# Altium project SYZYGY_PMOD_Schield.PrjPcb
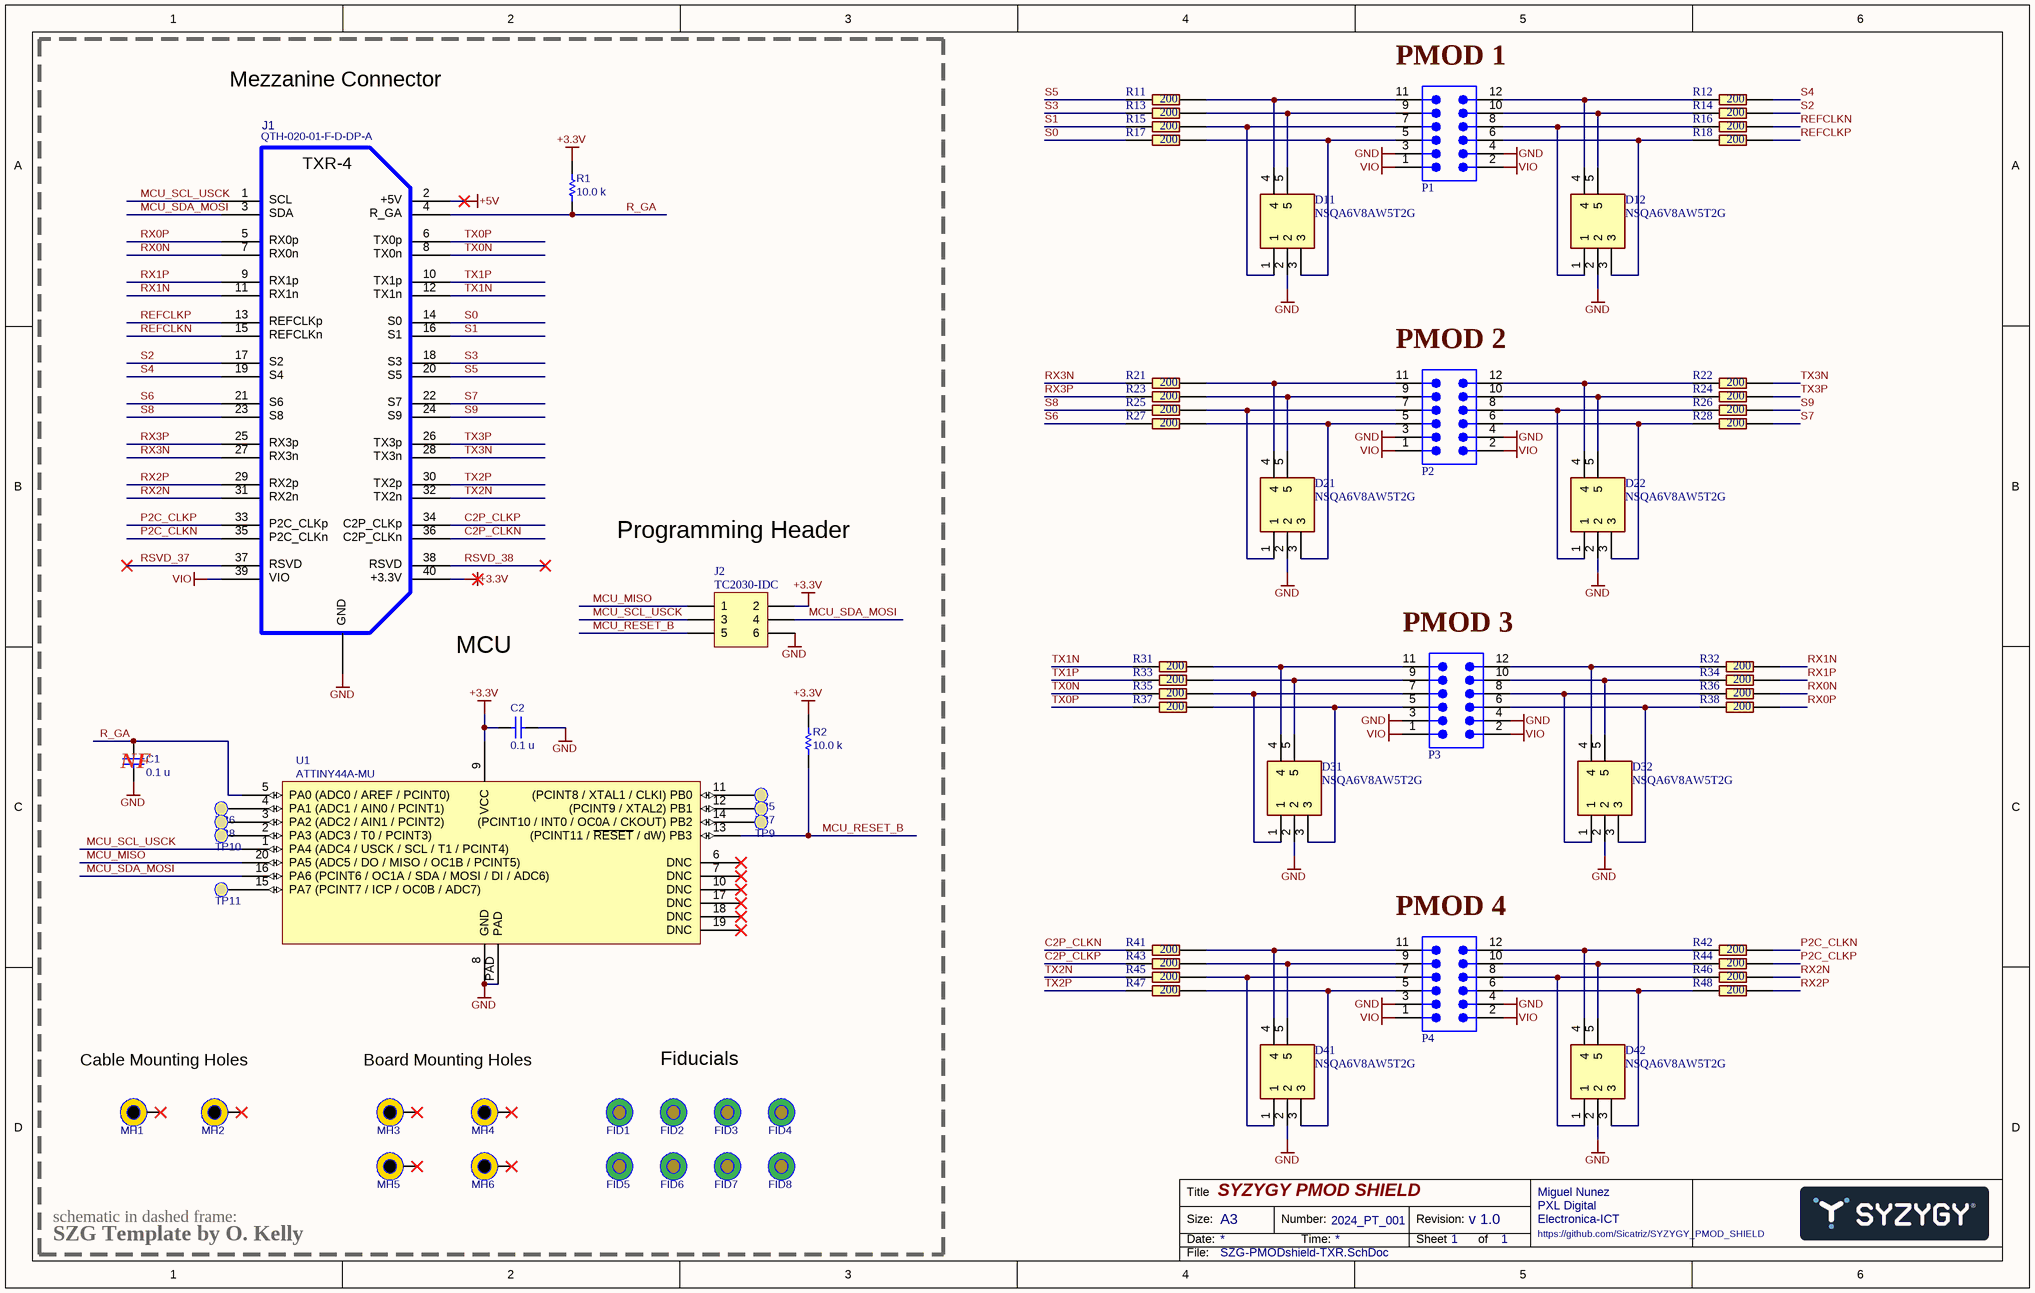
[diagram p0: SZG-PMODshield-TXR.SchDoc]
1 sheet, 72 parts. Net scope: global (net labels, ports and power ports of the same name join across sheets).
Board file: SZG-PMOD-TXR.PcbDoc

## Sheet SZG-PMODshield-TXR.SchDoc: SZG-TEMPLATE-TXR
size B; Organization: Opal Kelly; Address1: 13500 SW 72nd Ave STE 100; Address2: Portland, OR  97223; Address3: 217.391.3724; Address4: http://www.opalkelly.com; DocumentNumber: xxx; Revision: 1; SheetNumber: 1; SheetTotal: 1; PageSetup: Record=PageOptions|CenterHorizontal=True|CenterVertical=True|PrintScale=0.52|XCorrection=1.00|YCorrection=1.00|PrintKind=0|BorderSize=5000000|LeftOffset=0|BottomOffset=0|Orientation=2|PaperLength=1000|PaperWidth=1000|Scale=100|PaperSource=7|PrintQuality=-4|MediaType=1|DitherType=10|PaperKind=Letter|PrintScaleMode=1

### Parts
C1  value 0.1 u  [CAPC1005X06N]  (hidden comment: C0402C104K8PACTU)
C2  value 0.1 u  [CAPC1005X06N]  (hidden comment: C0402C104K8PACTU)
D11  NSQA6V8AW5T2G  [SOT65P210X110-5N]
D12  NSQA6V8AW5T2G  [SOT65P210X110-5N]
D21  NSQA6V8AW5T2G  [SOT65P210X110-5N]
D22  NSQA6V8AW5T2G  [SOT65P210X110-5N]
D31  NSQA6V8AW5T2G  [SOT65P210X110-5N]
D32  NSQA6V8AW5T2G  [SOT65P210X110-5N]
D41  NSQA6V8AW5T2G  [SOT65P210X110-5N]
D42  NSQA6V8AW5T2G  [SOT65P210X110-5N]
FID1  FIDUCIAL  [FID1MM/2MM-SS]  (value not drawn)
FID2  FIDUCIAL  [FID1MM/2MM-SS]  (value not drawn)
FID3  FIDUCIAL  [FID1MM/2MM-SS]  (value not drawn)
FID4  FIDUCIAL  [FID1MM/2MM-SS]  (value not drawn)
FID5  FIDUCIAL  [FID1MM/2MM-SS]  (value not drawn)
FID6  FIDUCIAL  [FID1MM/2MM-SS]  (value not drawn)
FID7  FIDUCIAL  [FID1MM/2MM-SS]  (value not drawn)
FID8  FIDUCIAL  [FID1MM/2MM-SS]  (value not drawn)
J1  manufacturer_pn: QTH-020-01-F-D-DP-A  [QTH-020-01-X-D-DP-A-L]  (hidden comment: 40-pin, ground protection in middle)
J2  Manufacturer_PN: TC2030-IDC  [TC2030-DUAL]
MH1  MTG  [MTG-3.2/6.5-PTH]  (value not drawn)
MH2  MTG  [MTG-3.2/6.5-PTH]  (value not drawn)
MH3  MTG  [MTG-3.2/6.5-PTH]  (value not drawn)
MH4  MTG  [MTG-3.2/6.5-PTH]  (value not drawn)
MH5  MTG  [MTG-3.2/6.5-PTH]  (value not drawn)
MH6  MTG  [MTG-3.2/6.5-PTH]  (value not drawn)
P1  61301221021  [61301221021]  (value not drawn)
P2  61301221021  [61301221021]  (value not drawn)
P3  61301221121  [61301221121]  (value not drawn)
P4  61301221121  [61301221121]  (value not drawn)
R1  value 10.0 k  [RESC1005X06N]  (hidden comment: CRCW040210K0FKED)
R2  value 10.0 k  [RESC1005X06N]  (hidden comment: CRCW040210K0FKED)
R11  200  [RESC2012X50N]
R12  200  [RESC2012X50N]
R13  200  [RESC2012X50N]
R14  200  [RESC2012X50N]
R15  200  [RESC2012X50N]
R16  200  [RESC2012X50N]
R17  200  [RESC2012X50N]
R18  200  [RESC2012X50N]
R21  200  [RESC2012X50N]
R22  200  [RESC2012X50N]
R23  200  [RESC2012X50N]
R24  200  [RESC2012X50N]
R25  200  [RESC2012X50N]
R26  200  [RESC2012X50N]
R27  200  [RESC2012X50N]
R28  200  [RESC2012X50N]
R31  200  [RESC2012X50N]
R32  200  [RESC2012X50N]
R33  200  [RESC2012X50N]
R34  200  [RESC2012X50N]
R35  200  [RESC2012X50N]
R36  200  [RESC2012X50N]
R37  200  [RESC2012X50N]
R38  200  [RESC2012X50N]
R41  200  [RESC2012X50N]
R42  200  [RESC2012X50N]
R43  200  [RESC2012X50N]
R44  200  [RESC2012X50N]
R45  200  [RESC2012X50N]
R46  200  [RESC2012X50N]
R47  200  [RESC2012X50N]
R48  200  [RESC2012X50N]
TP5  TESTPOINT-SMD20  [TP-SMD20]  (value not drawn)
TP6  TESTPOINT-SMD20  [TP-SMD20]  (value not drawn)
TP7  TESTPOINT-SMD20  [TP-SMD20]  (value not drawn)
TP8  TESTPOINT-SMD20  [TP-SMD20]  (value not drawn)
TP9  TESTPOINT-SMD20  [TP-SMD20]  (value not drawn)
TP10  TESTPOINT-SMD20  [TP-SMD20]  (value not drawn)
TP11  TESTPOINT-SMD20  [TP-SMD20]  (value not drawn)
U1  ATTINY44A-MU  [QFN-EP-20]

### Nets
+3.3V: C2.2 J1.40 J2.2 R1.2 R2.2 U1.9(VCC)
+5V: J1.2
GND: C1.1 C2.1 D11.2 D12.2 D21.2 D22.2 D31.2 D32.2 D41.2 D42.2 J1.0(GND) J2.6 P1.3 P1.4 P2.3 P2.4 P3.3 P3.4 P4.3 P4.4 U1.8(GND) U1.PAD
VIO: J1.39 P1.1 P1.2 P2.1 P2.2 P3.1 P3.2 P4.1 P4.2
C2P_CLKN: J1.36 R41.1
C2P_CLKP: J1.34 R43.1
MCU_MISO: J2.1 U1.20(PA5_(ADC5_/_DO_/_MISO_/_OC1B_/_PCINT5))
MCU_RESET_B: J2.5 R2.1 U1.13((PCINT11_/_~{RESET}_/_dW)_PB3)
MCU_SCL_USCK: J1.1 J2.3 U1.1(PA4_(ADC4_/_USCK_/_SCL_/_T1_/_PCINT4))
MCU_SDA_MOSI: J1.3 J2.4 U1.16(PA6_(PCINT6_/_OC1A_/_SDA_/_MOSI_/_DI_/_ADC6))
P2C_CLKN: J1.35 R42.2
P2C_CLKP: J1.33 R44.2
R_GA: C1.2 J1.4 R1.1 U1.5(PA0_(ADC0_/_AREF_/_PCINT0))
REFCLKN: J1.15 R16.2
REFCLKP: J1.13 R18.2
RSVD_37: J1.37
RSVD_38: J1.38
RX0N: J1.7 R36.2
RX0P: J1.5 R38.2
RX1N: J1.11 R32.2
RX1P: J1.9 R34.2
RX2N: J1.31 R46.2
RX2P: J1.29 R48.2
RX3N: J1.27 R21.1
RX3P: J1.25 R23.1
S0: J1.14 R17.1
S1: J1.16 R15.1
S2: J1.17 R14.2
S3: J1.18 R13.1
S4: J1.19 R12.2
S5: J1.20 R11.1
S6: J1.21 R27.1
S7: J1.22 R28.2
S8: J1.23 R25.1
S9: J1.24 R26.2
TX0N: J1.8 R35.1
TX0P: J1.6 R37.1
TX1N: J1.12 R31.1
TX1P: J1.10 R33.1
TX2N: J1.32 R45.1
TX2P: J1.30 R47.1
TX3N: J1.28 R22.2
TX3P: J1.26 R24.2
NetD11_1: D11.1 P1.7 R15.2
NetD11_3: D11.3 P1.5 R17.2
NetD11_4: D11.4 P1.11 R11.2
NetD11_5: D11.5 P1.9 R13.2
NetD12_1: D12.1 P1.8 R16.1
NetD12_3: D12.3 P1.6 R18.1
NetD12_4: D12.4 P1.12 R12.1
NetD12_5: D12.5 P1.10 R14.1
NetD21_1: D21.1 P2.7 R25.2
NetD21_3: D21.3 P2.5 R27.2
NetD21_4: D21.4 P2.11 R21.2
NetD21_5: D21.5 P2.9 R23.2
NetD22_1: D22.1 P2.8 R26.1
NetD22_3: D22.3 P2.6 R28.1
NetD22_4: D22.4 P2.12 R22.1
NetD22_5: D22.5 P2.10 R24.1
NetD31_1: D31.1 P3.7 R35.2
NetD31_3: D31.3 P3.5 R37.2
NetD31_4: D31.4 P3.11 R31.2
NetD31_5: D31.5 P3.9 R33.2
NetD32_1: D32.1 P3.8 R36.1
NetD32_3: D32.3 P3.6 R38.1
NetD32_4: D32.4 P3.12 R32.1
NetD32_5: D32.5 P3.10 R34.1
NetD41_1: D41.1 P4.7 R45.2
NetD41_3: D41.3 P4.5 R47.2
NetD41_4: D41.4 P4.11 R41.2
NetD41_5: D41.5 P4.9 R43.2
NetD42_1: D42.1 P4.8 R46.1
NetD42_3: D42.3 P4.6 R48.1
NetD42_4: D42.4 P4.12 R42.1
NetD42_5: D42.5 P4.10 R44.1
NetTP5_1: TP5.1(PIN) U1.11((PCINT8_/_XTAL1_/_CLKI)_PB0)
NetTP6_1: TP6.1(PIN) U1.4(PA1_(ADC1_/_AIN0_/_PCINT1))
NetTP7_1: TP7.1(PIN) U1.12((PCINT9_/_XTAL2)_PB1)
NetTP8_1: TP8.1(PIN) U1.3(PA2_(ADC2_/_AIN1_/_PCINT2))
NetTP9_1: TP9.1(PIN) U1.14((PCINT10_/_INT0_/_OC0A_/_CKOUT)_PB2)
NetTP10_1: TP10.1(PIN) U1.2(PA3_(ADC3_/_T0_/_PCINT3))
NetTP11_1: TP11.1(PIN) U1.15(PA7_(PCINT7_/_ICP_/_OC0B_/_ADC7))

Not connected (* = marked no-connect by the designer): MH1 1*; MH2 1*; MH3 1*; MH4 1*; MH5 1*; MH6 1*; U1 6(DNC)* 7(DNC)* 10(DNC)* 17(DNC)* 18(DNC)* 19(DNC)*

### Notes on the sheet
- Mezzanine Connector
- (near P1) PMOD 1
- (near P2) PMOD 2
- Programming Header
- (near P3) PMOD 3
- MCU
- (near C1) NF
- (near P4) PMOD 4
- Cable Mounting Holes
- Board Mounting Holes
- Fiducials
- SZG Template by O. Kelly
- schematic in dashed frame:
- Title
- Size:
- Date:
- SYZYGY PMOD SHIELD
- A3
- Number:
- Time:
- 2024_PT_001
- Revision:
- Sheet
- v 1.0
- of
- Miguel Nunez
- PXL Digital
- Electronica-ICT
- https://github.com/Sicatriz/SYZYGY_PMOD_SHIELD
- File:
- (in symbol 001605) TXR-4; SCL; +5V; SDA; R_GA; RX0p; TX0p; RX0n; TX0n; RX1p; TX1p; RX1n; TX1n; REFCLKp; S0; REFCLKn; S1; S2; S3; S4; S5; S6; S7; S8; S9; RX3p; TX3p; RX3n; TX3n; RX2p; TX2p; RX2n; TX2n; P2C_CLKp; C2P_CLKp; P2C_CLKn; C2P_CLKn; RSVD; VIO; +3.3V

### Library data of the parts
C1 C2 = 000070: Ceramic capacitor; Manufacturer: Kemet; partnumber: 000070; Description 2: SM-0402, 10%, 10v; ValueFloat: 1E-7; Tolerance (%): 10; Manufacturer_PN: C0402C104K8PACTU
  C1: updated_on: 5/15/2017 4:50:04 PM
  C2: updated_on: 11/17/2016 12:16:56 PM
D11 D12 D21 D22 D31 D32 D41 D42 = NSQA6V8AW5T2G: Diode; Manufacturer_Name: onsemi; Datasheet Link: http://www.onsemi.com/pub/Collateral/NSQA6V8AW5T2-D.PDF; Height: 1.1mm; Manufacturer_Part_Number: NSQA6V8AW5T2G; Mouser Part Number: 863-NSQA6V8AW5T2G; Mouser Price/Stock: https://www.mouser.co.uk/ProductDetail/onsemi/NSQA6V8AW5T2G?qs=ZXBb0xZ9WeDSeR92l0JbzA%3D%3D; Arrow Part Number: NSQA6V8AW5T2G; Arrow Price/Stock: https://www.arrow.com/en/products/nsqa6v8aw5t2g/on-semiconductor?region=nac
FID1-FID8 = FIDUCIAL: PCB fiducial
J1 = 001605: 0.5mm hi-speed, high-density header (female); manufacturer: Samtec; AligniPartNumber: 001605; parttype: Connector
J2 = 002062: Tag-Connect 6-pin Plug-of-Nails spring-pin cable footprint; AligniPartNumber: 002062; Manufacturer: Tag-Connect; parttype: Connector
MH1-MH6 = MTG: Mounting hole
P1 P2 = 61301221021: WR-PHD Pin Header, THT, Angled, pitch 2.54mm, 2 Row, 12P; Manufacturer: Wurth Elektronik; Contact Resistance: 20mΩ; Rated Current: 3A; Working Voltage: 250V; Withstanding Voltage: 500V; ComponentLink1Description: Website Link; ComponentLink1URL: https://www.we-online.com/redexpert/article/61301221021?ad; ComponentLink2Description: Datasheet Link; ComponentLink2URL: https://www.we-online.com/redexpert/spec/61301221021?ad; Manufacturer Part Number: 61301221021; Category: Board-to-Board Connectors; Match Code: WR-PHD; Mount: Through Hole; Operating Temperature Max: 105°C; Operating Temperature Min: -40°C; Packaging: Bag; Gender: Pin Header; Number of Pins: 12; Number of Rows: 2; Orientation: Angled; Pitch: 2.54mm
P3 P4 = 61301221121: WR-PHD Pin Header, THT, Vertical, pitch 2.54mm, 2 Row, 12P; Manufacturer: Wurth Elektronik; Contact Resistance: 20mΩ; Rated Current: 3A; Working Voltage: 250V; Withstanding Voltage: 500V; ComponentLink1Description: Website Link; ComponentLink1URL: https://www.we-online.com/redexpert/article/61301221121?ad; ComponentLink2Description: Datasheet Link; ComponentLink2URL: https://www.we-online.com/redexpert/spec/61301221121?ad; Manufacturer Part Number: 61301221121; Category: Board-to-Board Connectors; Match Code: WR-PHD; Mount: Through Hole; Operating Temperature Max: 105°C; Operating Temperature Min: -40°C; Packaging: Bag; Gender: Pin Header; Number of Pins: 12; Number of Rows: 2; Orientation: Vertical; Pitch: 2.54mm
R1 R2 = 001521: Thick-film resistor; Manufacturer: Vishay; partnumber: 001521; Description 2: SM-0402, 1%, 1/16W; ValueFloat: 10000; Tolerance (%): 1; x_lifecycle_status: Production; Manufacturer_PN: CRCW040210K0FKED; updated_on: 3/21/2017 2:29:49 PM
R11-R18 R21-R28 R31-R38 R41-R48 = 0805_SMD_Resistor: Resistor; Manufacturer_Name: Vishay; Manufacturer_Part_Number: CRCW08055K60JNEA; Datasheet Link: http://www.vishay.com/docs/20035/dcrcwe3.pdf; Height: 0.5mm
TP5-TP11 = TESTPOINT-SMD20: Test point, surface-mount, 20mil
U1 = 001552: 8-bit MCU, 4 KB flash, 256 bytes EEPROM; Manufacturer: Microchip; partnumber: 001552; x_lifecycle_status: Production; Manufacturer_PN: ATTINY44A-MU; updated_on: 5/23/2017 10:51:21 AM